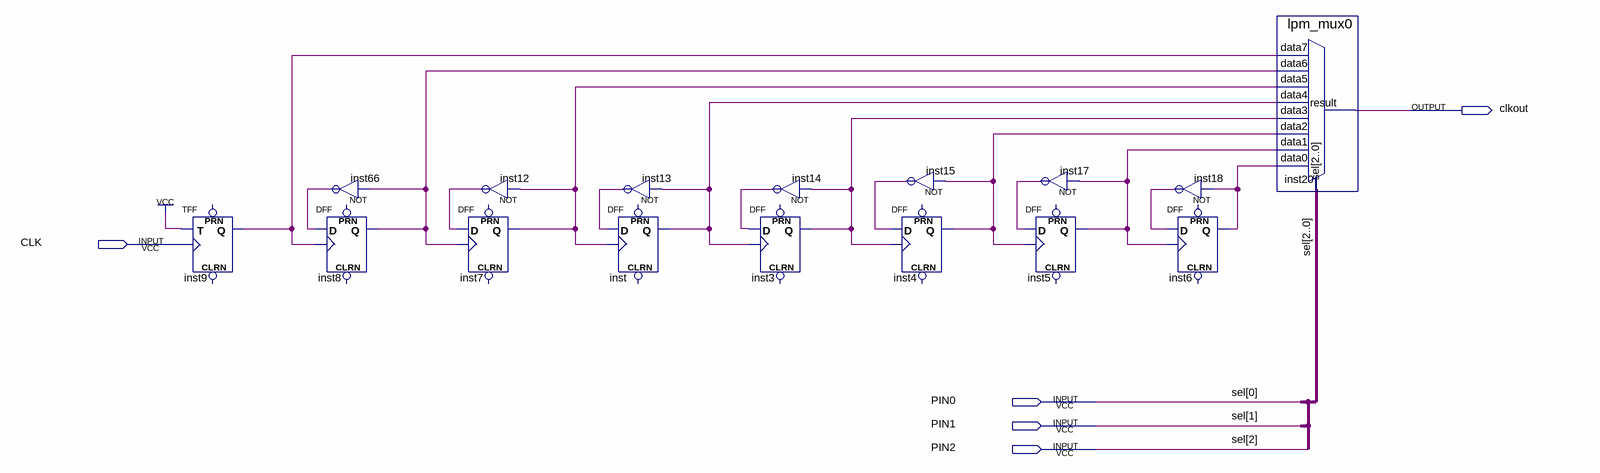
[diagram p0: schematic sheet]
// Quartus schematic velocidade2.bdf as structural Verilog: 16 symbols, 5 pins
module velocidade2 (
  input  CLK,
  input  PIN0,
  input  PIN1,
  input  PIN2,
  output clkout
);

  wire inst3_q, inst4_q, inst5_q, inst6_q, inst7_q, inst8_q, inst9_q, inst12_out, inst13_out, inst14_out,
       inst15_out, inst17_out, inst18_out, inst66_out, inst_q;

  TFF inst9 (.T(1'b1), .CLK(CLK), .Q(inst9_q));  // open: PRN, CLRN
  DFF inst8 (.CLK(inst9_q), .D(inst66_out), .Q(inst8_q));  // open: CLRN, PRN
  not inst66 (inst66_out, inst8_q);
  not inst12 (inst12_out, inst7_q);
  DFF inst7 (.CLK(inst8_q), .D(inst12_out), .Q(inst7_q));  // open: CLRN, PRN
  not inst13 (inst13_out, inst_q);
  DFF inst (.CLK(inst7_q), .D(inst13_out), .Q(inst_q));  // open: CLRN, PRN
  DFF inst3 (.CLK(inst_q), .D(inst14_out), .Q(inst3_q));  // open: CLRN, PRN
  not inst14 (inst14_out, inst3_q);
  DFF inst4 (.CLK(inst3_q), .D(inst15_out), .Q(inst4_q));  // open: CLRN, PRN
  not inst15 (inst15_out, inst4_q);
  not inst17 (inst17_out, inst5_q);
  DFF inst5 (.CLK(inst4_q), .D(inst17_out), .Q(inst5_q));  // open: CLRN, PRN
  not inst18 (inst18_out, inst6_q);
  DFF inst6 (.CLK(inst5_q), .D(inst18_out), .Q(inst6_q));  // open: CLRN, PRN
  lpm_mux0 inst20 (
    .data7(inst9_q), .data6(inst8_q), .data5(inst7_q), .data4(inst_q), .data3(inst3_q), .data2(inst4_q),
    .data1(inst5_q), .data0(inst6_q), .sel({PIN2, PIN1, PIN0}), .result(clkout));

  // Other names for the same wires on the sheet: sel[2:0] = {PIN2, PIN1, PIN0}
endmodule
